# EAGLE design hires-Addon Build 003 (EAGLE 9.6.2)
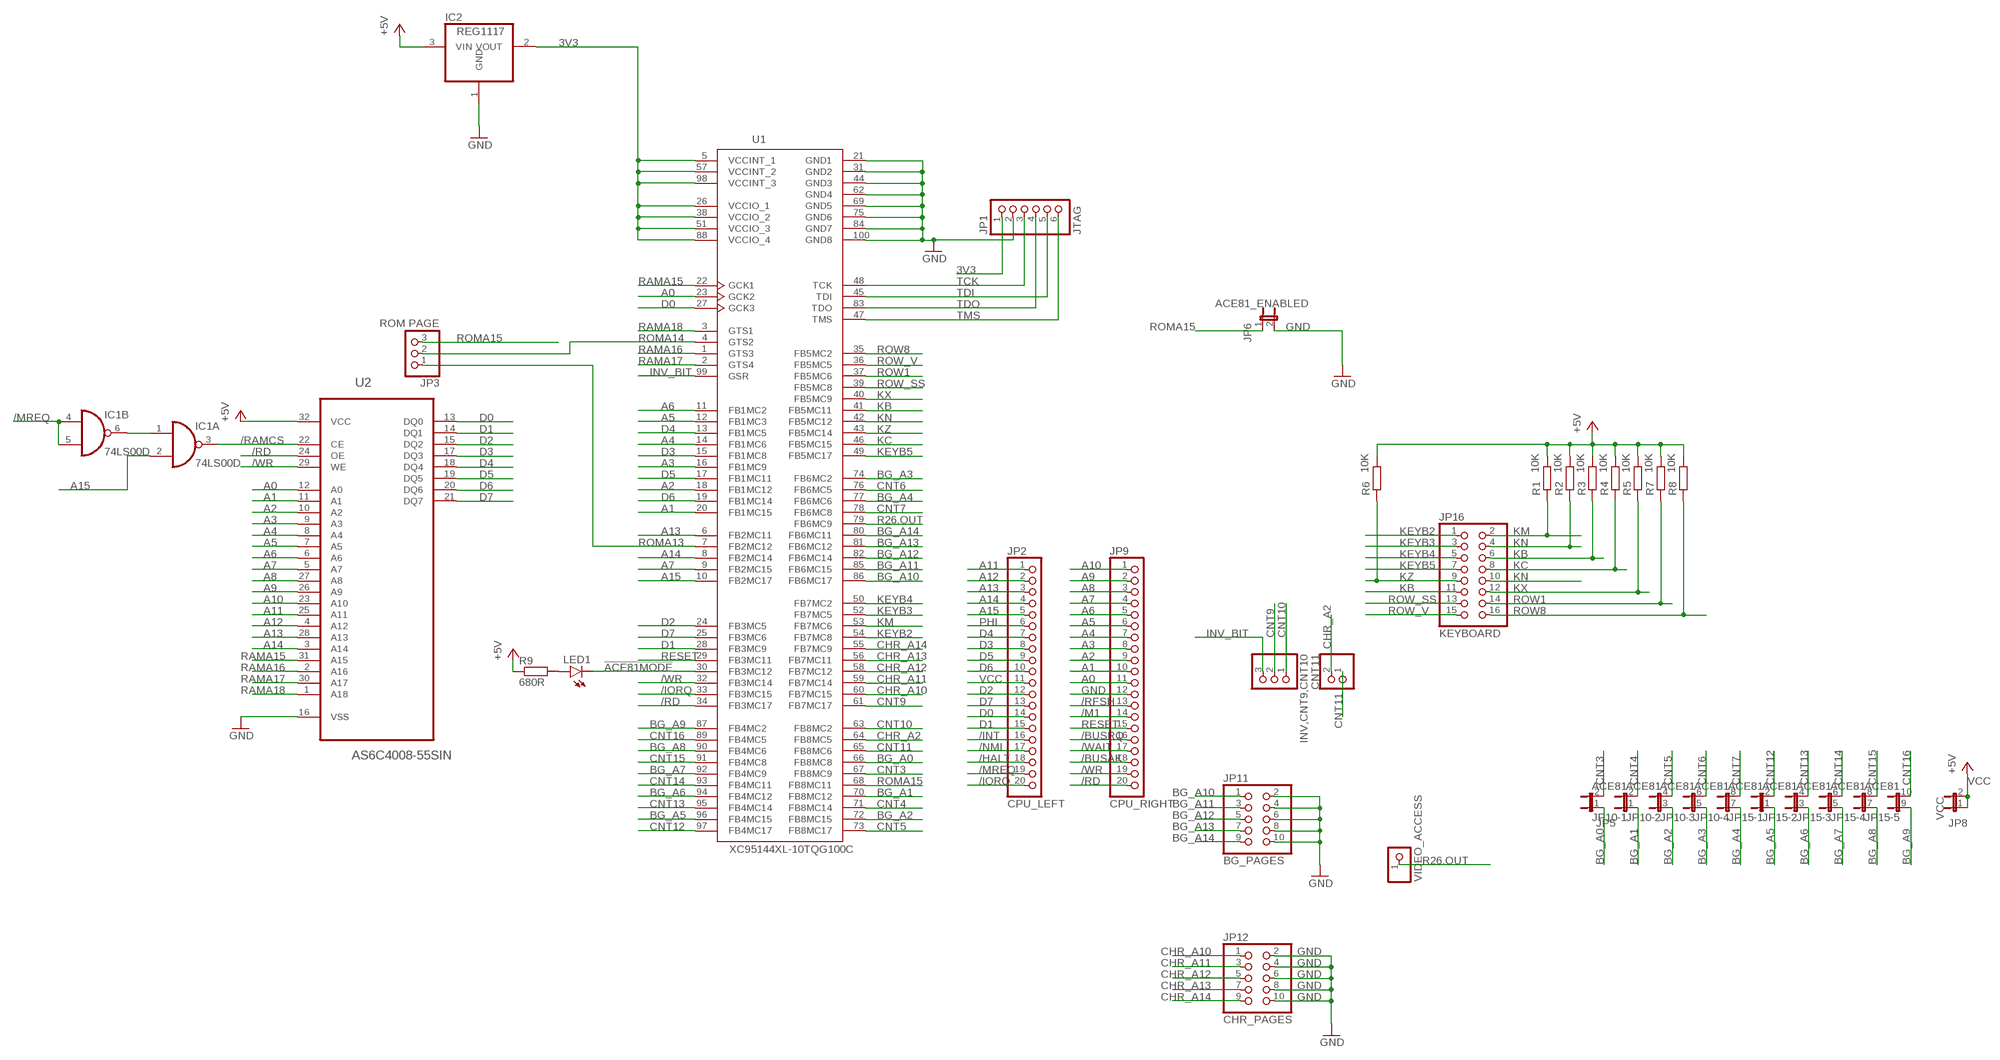
[diagram p0: schematic, sheet 1]

## Parts
CNT11  PINHD-1X2  [1X02]
IC1  74LS00D  [SO14]
IC2  REG1117  [SOT223]
INV,CNT9,CNT10  PINHD-1X3  [1X03]
JP1  JTAG  PINHD-1X6/90  [1X06/90]
JP2  CPU_LEFT  PINHD-1X20  [1X20]
JP3  ROM PAGE  PINHD-1X3  [1X03]
JP5  JP1E1Q  [JP1Q]
JP6  ACE81_ENABLED  JP1E1Q  [JP1Q]
JP8  VCC  JP1E1Q  [JP1Q]
JP9  CPU_RIGHT  PINHD-1X20  [1X20]
JP10  ACE81  JP4QE  [JP4Q]
JP11  BG_PAGES  PINHD-2X5  [2X05]
JP12  CHR_PAGES  PINHD-2X5  [2X05]
JP14  VIDEO_ACCESS  PINHD-1X1  [1X01]
JP15  ACE81  JP5QE  [JP5Q]
JP16  KEYBOARD  PINHD-2X8  [2X08]
LED1  LED3MM  [LED3MM]
R1  10K  R-EU_0204/7  [0204/7]
R2  10K  R-EU_0204/7  [0204/7]
R3  10K  R-EU_0204/7  [0204/7]
R4  10K  R-EU_0204/7  [0204/7]
R5  10K  R-EU_0204/7  [0204/7]
R6  10K  R-EU_0204/7  [0204/7]
R7  10K  R-EU_0204/7  [0204/7]
R8  10K  R-EU_0204/7  [0204/7]
R9  680R  R-EU_0204/7  [0204/7]
U1  XC95144XL-10TQG100C  [TQFP100]
U2  AS6C4008-55SIN  [SOIC127P1407X299-32N]

## Nets
3V3 [power]: IC2.2(VOUT) JP1.1 U1.5(VCCINT_1) U1.26(VCCIO_1) U1.38(VCCIO_2) U1.51(VCCIO_3) U1.57(VCCINT_2) U1.88(VCCIO_4) U1.98(VCCINT_3)
!ACE81MODE: LED1.K(C) U1.30(FB3MC12)
/BUSAK: JP9.18
/BUSRQ: JP9.16
/HALT: JP2.18
/INT: JP2.16
/IORQ: JP2.20 U1.33(FB3MC15)
/M1: JP9.14
/MREQ: IC1.4(B:I0) IC1.5(B:I1) JP2.19
/NMI: JP2.17
/RAMCS: IC1.3(A:O) U2.22(CE)
/RD: JP9.20 U1.34(FB3MC17) U2.24(OE)
/RFSH: JP9.13
/WAIT: JP9.17
/WR: JP9.19 U1.32(FB3MC14) U2.29(WE)
A0: JP9.11 U1.23(GCK2) U2.12(A0)
A1: JP9.10 U1.20(FB1MC15) U2.11(A1)
A2: JP9.9 U1.18(FB1MC12) U2.10(A2)
A3: JP9.8 U1.16(FB1MC9) U2.9(A3)
A4: JP9.7 U1.14(FB1MC6) U2.8(A4)
A5: JP9.6 U1.12(FB1MC3) U2.7(A5)
A6: JP9.5 U1.11(FB1MC2) U2.6(A6)
A7: JP9.4 U1.9(FB2MC15) U2.5(A7)
A8: JP9.3 U2.27(A8)
A9: JP9.2 U2.26(A9)
A10: JP9.1 U2.23(A10)
A11: JP2.1 U2.25(A11)
A12: JP2.2 U2.4(A12)
A13: JP2.3 U1.6(FB2MC11) U2.28(A13)
A14: JP2.4 U1.8(FB2MC14) U2.3(A14)
A15: IC1.2(A:I1) JP2.5 U1.10(FB2MC17)
BG_A0: JP5.1 U1.66(FB8MC8)
BG_A1: JP10.1 U1.70(FB8MC12)
BG_A2: JP10.3 U1.72(FB8MC15)
BG_A3: JP10.5 U1.74(FB6MC2)
BG_A4: JP10.7 U1.77(FB6MC6)
BG_A5: JP15.1 U1.96(FB4MC15)
BG_A6: JP15.3 U1.94(FB4MC12)
BG_A7: JP15.5 U1.92(FB4MC9)
BG_A8: JP15.7 U1.90(FB4MC6)
BG_A9: JP15.9 U1.87(FB4MC2)
BG_A10: JP11.1 U1.86(FB6MC17)
BG_A11: JP11.3 U1.85(FB6MC15)
BG_A12: JP11.5 U1.82(FB6MC14)
BG_A13: JP11.7 U1.81(FB6MC12)
BG_A14: JP11.9 U1.80(FB6MC11)
CHR_A2: CNT11.2 U1.64(FB8MC5)
CHR_A10: JP12.1 U1.60(FB7MC15)
CHR_A11: JP12.3 U1.59(FB7MC14)
CHR_A12: JP12.5 U1.58(FB7MC12)
CHR_A13: JP12.7 U1.56(FB7MC11)
CHR_A14: JP12.9 U1.55(FB7MC9)
CNT3: JP5.2 U1.67(FB8MC9)
CNT4: JP10.2 U1.71(FB8MC14)
CNT5: JP10.4 U1.73(FB8MC17)
CNT6: JP10.6 U1.76(FB6MC5)
CNT7: JP10.8 U1.78(FB6MC8)
CNT9: INV,CNT9,CNT10.2 U1.61(FB7MC17)
CNT10: INV,CNT9,CNT10.1 U1.63(FB8MC2)
CNT11: CNT11.1 U1.65(FB8MC6)
CNT12: JP15.2 U1.97(FB4MC17)
CNT13: JP15.4 U1.95(FB4MC14)
CNT14: JP15.6 U1.93(FB4MC11)
CNT15: JP15.8 U1.91(FB4MC8)
CNT16: JP15.10 U1.89(FB4MC5)
D0: JP2.14 U1.27(GCK3) U2.13(DQ0)
D1: JP2.15 U1.28(FB3MC9) U2.14(DQ1)
D2: JP2.12 U1.24(FB3MC5) U2.15(DQ2)
D3: JP2.8 U1.15(FB1MC8) U2.17(DQ3)
D4: JP2.7 U1.13(FB1MC5) U2.18(DQ4)
D5: JP2.9 U1.17(FB1MC11) U2.19(DQ5)
D6: JP2.10 U1.19(FB1MC14) U2.20(DQ6)
D7: JP2.13 U1.25(FB3MC6) U2.21(DQ7)
GND [power]: IC2.1(GND) JP1.2 JP6.2 JP9.12 JP11.2 JP11.4 JP11.6 JP11.8 JP11.10 JP12.2 JP12.4 JP12.6 JP12.8 JP12.10 U1.21(GND1) U1.31(GND2) U1.44(GND3) U1.62(GND4) U1.69(GND5) U1.75(GND6) U1.84(GND7) U1.100(GND8) U2.16(VSS)
INV_BIT: INV,CNT9,CNT10.3 U1.99(GSR)
KB: JP16.6 JP16.11 R3.1 U1.41(FB5MC11)
KC: JP16.8 R4.1 U1.46(FB5MC15)
KEYB2: JP16.1 U1.54(FB7MC8)
KEYB3: JP16.3 U1.52(FB7MC5)
KEYB4: JP16.5 U1.50(FB7MC2)
KEYB5: JP16.7 U1.49(FB5MC17)
KM: JP16.2 R1.1 U1.53(FB7MC6)
KN: JP16.4 JP16.10 R2.1 U1.42(FB5MC12)
KX: JP16.12 R5.1 U1.40(FB5MC9)
KZ: JP16.9 R6.1 U1.43(FB5MC14)
N$1: IC1.1(A:I0) IC1.6(B:O)
N$3: LED1.A R9.2
PHI: JP2.6
R26.OUT: JP14.1 U1.79(FB6MC9)
RAMA15: U1.22(GCK1) U2.31(A15)
RAMA16: U1.1(GTS3) U2.2(A16)
RAMA17: U1.2(GTS4) U2.30(A17)
RAMA18: U1.3(GTS1) U2.1(A18)
RESET: JP9.15 U1.29(FB3MC11)
ROMA13: JP3.1 U1.7(FB2MC12)
ROMA14: JP3.2 U1.4(GTS2)
ROMA15: JP3.3 JP6.1 U1.68(FB8MC11)
ROW1: JP16.14 R7.1 U1.37(FB5MC6)
ROW8: JP16.16 R8.1 U1.35(FB5MC2)
ROW_SS: JP16.13 U1.39(FB5MC8)
ROW_V: JP16.15 U1.36(FB5MC5)
TCK: JP1.3 U1.48(TCK)
TDI: JP1.5 U1.45(TDI)
TDO: JP1.4 U1.83(TDO)
TMS: JP1.6 U1.47(TMS)
VCC [power]: IC2.3(VIN) JP2.11 JP8.1 JP8.2 R1.2 R2.2 R3.2 R4.2 R5.2 R6.2 R7.2 R8.2 R9.1 U2.32(VCC) ; supply symbol labelled +5V
Unconnected: IC1.8(C:O) IC1.9(C:I0) IC1.10(C:I1) IC1.11(D:O) IC1.12(D:I0) IC1.13(D:I1)

## Power pins joined to a net without a drawn wire
GND: IC1.7(P:GND)
VCC: IC1.14(P:VCC)

## Library data of the parts
CNT11 = pinhead:PINHD-1X2: PIN HEADER
IC1 = 74xx-eu:74*00: Quad 2-input NAND gate
IC2 = burr-brown:REG1117: 800mA and 1A Low Dropout (LDO) Positive Regulator 1.8V, 2.5V, 2.85V, 3.3V, 5V, and Adj; MPN: REG1117; OC_FARNELL: 1097566; OC_NEWARK: 14P6981
INV,CNT9,CNT10 JP3 = pinhead:PINHD-1X3: PIN HEADER
JP1 = pinhead:PINHD-1X6: PIN HEADER
JP2 JP9 = pinhead:PINHD-1X20: PIN HEADER
JP5 JP6 JP8 = jumper:JP1E: JUMPER
JP10 = jumper:JP4QE: JUMPER
JP11 JP12 = pinhead:PINHD-2X5: PIN HEADER
JP14 = pinhead:PINHD-1X1: PIN HEADER
JP15 = jumper:JP5QE: JUMPER
JP16 = pinhead:PINHD-2X8: PIN HEADER
LED1 = led:LED: LED OSRAM: - CHIPLED LG R971, LG N971, LY N971, LG Q971, LY Q971, LO R971, LY R971 LH N974, LH R974 LS Q976, LO Q976, LY Q976 LO Q996 - Hyper CHIPLED LW Q18S LB Q993, LB Q99A, LB R99A - SideLED LS A670, LO A670, LY A670, LG A670, LP A670 LB A673, LV A673, LT A673, LW A673 LH A674 LY A675 LS A676, LA A676, LO A676, LY A676, LW A676 LS A679, LY A679, LG A679 - Hyper Micro SIDELED® LS Y876, LA Y876, LO Y876, LY Y876 LT Y87S - SmartLED LW L88C, LW L88S LB L89C, LB L89S, LG L890 LS L89K, LO L89K, LY L89K LS L896, LA L896, LO L896, LY L896 - TOPLED LS T670, LO T670, LY T670, LG T670, LP T670 LSG T670, LSP T670, LSY T670, LOP T670, LYG T670 LG T671, LOG T671, LSG T671 LB T673, LV T673, LT T673, LW T673 LH T674 LS T676, LA T676, LO T676, LY T676, LB T676, LH T676, LSB T676, LW T676 LB T67C, LV T67C, LT T67C, LS T67K, LO T67K, LY T67K, LW E67C LS E67B, LA E67B, LO E67B, LY E67B, LB E67C, LV E67C, LT E67C LW T67C LS T679, LY T679, LG T679 LS T770, LO T770, LY T770, LG T770, LP T770 LB T773, LV T773, LT T773, LW T773 LH T774 LS E675, LA E675, LY E675, LS T675 LS T776, LA T776, LO T776, LY T776, LB T776 LHGB T686 LT T68C, LB T68C - Hyper Mini TOPLED® LB M676 - Mini TOPLED Santana® LG M470 LS M47K, LO M47K, LY M47K Source: http://www.osram.convergy.de LUXEON: - LUMILED® LXK2-PW12-R00, LXK2-PW12-S00, LXK2-PW14-U00, LXK2-PW14-V00 LXK2-PM12-R00, LXK2-PM12-S00, LXK2-PM14-U00 LXK2-PE12-Q00, LXK2-PE12-R00, LXK2-PE12-S00, LXK2-PE14-T00, LXK2-PE14-U00 LXK2-PB12-K00, LXK2-PB12-L00, LXK2-PB12-M00, LXK2-PB14-N00, LXK2-PB14-P00, LXK2-PB14-Q00 LXK2-PR12-L00, LXK2-PR12-M00, LXK2-PR14-Q00, LXK2-PR14-R00 LXK2-PD12-Q00, LXK2-PD12-R00, LXK2-PD12-S00 LXK2-PH12-R00, LXK2-PH12-S00 LXK2-PL12-P00, LXK2-PL12-Q00, LXK2-PL12-R00 Source: www.luxeon.com KINGBRIGHT: KA-3528ASYC Source: www.kingbright.com
R1-R9 = rcl:R-EU_: RESISTOR, European symbol; SPICEPREFIX: R
U1 = XC95144XL-10TQG100C:XC95144XL-10TQG100C: Xilinx 9500XL series CPLD, 144 Macrocells, -10 speed grade. 100pin. Check availability <https://pricing.snapeda.com/parts/XC95144XL-10TQG100C/Xilinx%20Inc./view-part?ref=eda>; AVAILABILITY: In Stock; DESCRIPTION: IC CPLD 144MC 10NS 100TQFP; MF: Xilinx Inc.; MP: XC95144XL-10TQG100C; PACKAGE: TQFP-100 Xilinx; PRICE: None; PURCHASE-URL: https://pricing.snapeda.com/search/part/XC95144XL-10TQG100C/?ref=eda
U2 = AS6C4008-55SIN:AS6C4008-55SIN: CMOS SRAM Check availability <https://pricing.snapeda.com/parts/AS6C4008-55SIN/Alliance/view-part?ref=eda>; AVAILABILITY: In Stock; DESCRIPTION: SRAM - Asynchronous Memory IC 4Mb (512K x 8) Parallel 55 ns 32-SOP; MF: Alliance; MP: AS6C4008-55SIN; PACKAGE: SOIC-32 Alliance; PRICE: None; PURCHASE-URL: https://pricing.snapeda.com/search/part/AS6C4008-55SIN/?ref=eda

## Net classes
0 default: width 0.2 mm
1 power: width 0.2 mm

## Board
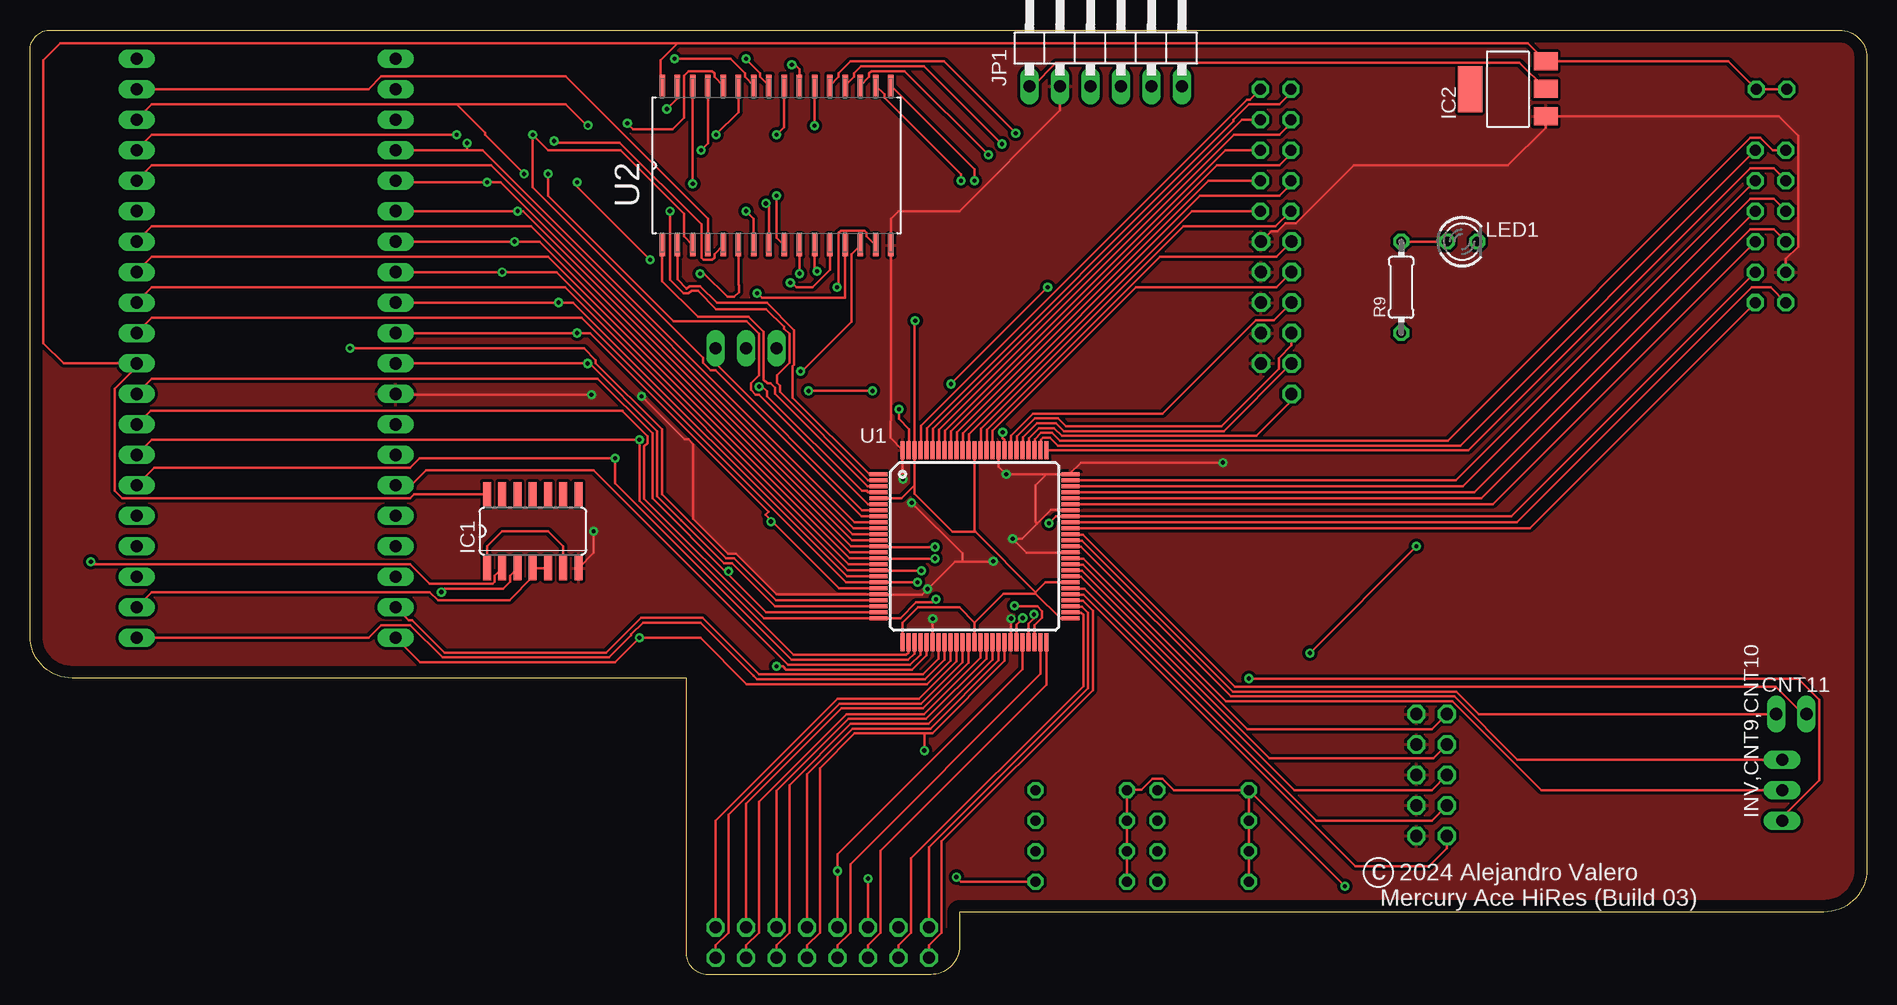
[diagram p1: board, top side]
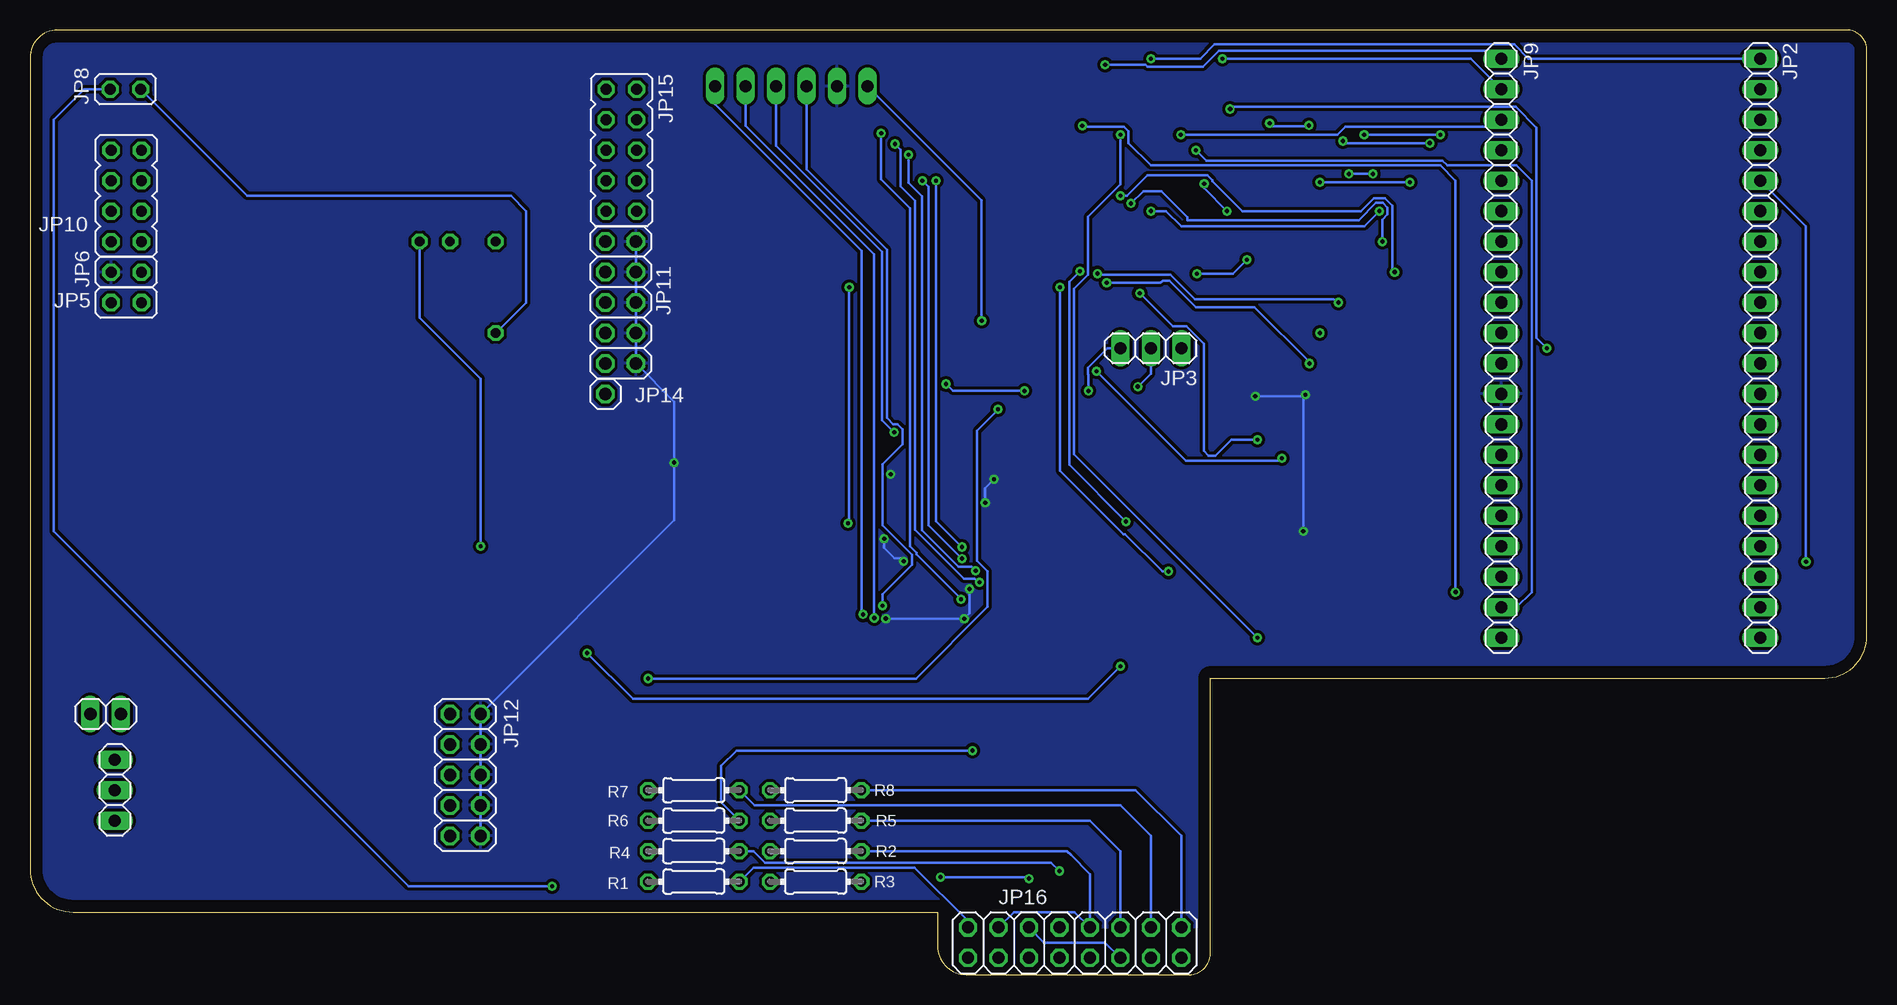
[diagram p2: board, bottom side, seen from below]

Size 153.12 x 78.72 mm. Coordinates in mm from the lower left corner, seen from the top.
Outline: 77.47,5.21 77.47,2.38 arc-90 75.09,0 56.47,0 arc-90 54.74,1.73 54.74,24.71 3.53,24.71 arc-90 0,28.24 0,77.02 arc-90 1.69,78.72 150.84,78.72 arc-90 153.12,76.44 153.12,8.79 arc-90 149.54,5.21 77.47,5.21
Copper layers (1*16): Top 0.035mm / dielectric 1.5mm / Bottom 0.035mm
Design rules "default *": minimum track width 6mil, minimum drill 10mil, track to track 8mil, track to pad 8mil, pad to pad 8mil, via to via 8mil, smd to smd 8mil, copper to edge 40mil, drill to drill 8mil, minimum pad ring 10mil, minimum via ring 8mil, stop-mask expansion 4mil, vias tented up to drill 0mil, thermal gap 10mil
vRestrict: area 14,-5 to 29.2,5.2

### Footprints (pad centres in the part's own frame; a part is rotated, then mirrored left to right if it is on the bottom)
1X02 = drill 1.016 long: 1 -1.27,0; 2 1.27,0
SO14 = smd 0.66 x 2.032: 1 -3.81,-3.073; 2 -2.54,-3.073; 3 -1.27,-3.073; 4 0,-3.073; 5 1.27,-3.073; 6 2.54,-3.073; 7 3.81,-3.073; 8 3.81,3.073; 9 2.54,3.073; 10 1.27,3.073; 11 0,3.073; 12 -1.27,3.073; 13 -2.54,3.073; 14 -3.81,3.073
SOT223 = smd 1.499 x 2.007: 1 -2.261,-3.15; 2 0.025,-3.15; 3 2.311,-3.15 | smd 3.81 x 2.007: 4 0,3.15
1X03 = drill 1.016 long: 1 -2.54,0; 2 0,0; 3 2.54,0
1X06/90 = drill 1.016 long: 1 -6.35,-3.81; 2 -3.81,-3.81; 3 -1.27,-3.81; 4 1.27,-3.81; 5 3.81,-3.81; 6 6.35,-3.81
1X20 = drill 1.016 long: 1 -24.13,0; 2 -21.59,0; 3 -19.05,0; 4 -16.51,0; 5 -13.97,0; 6 -11.43,0; 7 -8.89,0; 8 -6.35,0; 9 -3.81,0; 10 -1.27,0; 11 1.27,0; 12 3.81,0; 13 6.35,0; 14 8.89,0; 15 11.43,0; 16 13.97,0; 17 16.51,0; 18 19.05,0; 19 21.59,0; 20 24.13,0
JP1Q = drill 0.914 octagon: 1 -1.27,-1.27; 2 -1.27,1.27
JP4Q = drill 0.914 octagon: 1 -3.81,-1.27; 2 -3.81,1.27; 3 -1.27,-1.27; 4 -1.27,1.27; 5 1.27,-1.27; 6 1.27,1.27; 7 3.81,-1.27; 8 3.81,1.27
2X05 = drill 1.016 octagon: 1 -5.08,-1.27; 2 -5.08,1.27; 3 -2.54,-1.27; 4 -2.54,1.27; 5 0,-1.27; 6 0,1.27; 7 2.54,-1.27; 8 2.54,1.27; 9 5.08,-1.27; 10 5.08,1.27
1X01 = drill 1.016 octagon: 1 0,0
JP5Q = drill 0.914 octagon: 1 -5.08,-1.27; 2 -5.08,1.27; 3 -2.54,-1.27; 4 -2.54,1.27; 5 0,-1.27; 6 0,1.27; 7 2.54,-1.27; 8 2.54,1.27; 9 5.08,-1.27; 10 5.08,1.27
2X08 = drill 1.016 octagon: 1 -8.89,-1.27; 2 -8.89,1.27; 3 -6.35,-1.27; 4 -6.35,1.27; 5 -3.81,-1.27; 6 -3.81,1.27; 7 -1.27,-1.27; 8 -1.27,1.27; 9 1.27,-1.27; 10 1.27,1.27; 11 3.81,-1.27; 12 3.81,1.27; 13 6.35,-1.27; 14 6.35,1.27; 15 8.89,-1.27; 16 8.89,1.27
LED3MM = drill 0.813 octagon: A -1.27,0; K 1.27,0
0204/7 = drill 0.813 octagon: 1 -3.81,0; 2 3.81,0
TQFP100 = smd 1.5 x 0.345: 1 -8,6; 2 -8,5.5; 3 -8,5; 4 -8,4.5; 5 -8,4; 6 -8,3.5; 7 -8,3; 8 -8,2.5; 9 -8,2; 10 -8,1.5; 11 -8,1; 12 -8,0.5; 13 -8,0; 14 -8,-0.5; 15 -8,-1; 16 -8,-1.5; 17 -8,-2; 18 -8,-2.5; 19 -8,-3; 20 -8,-3.5; 21 -8,-4; 22 -8,-4.5; 23 -8,-5; 24 -8,-5.5; 25 -8,-6; 51 8,-6; 52 8,-5.5; 53 8,-5; 54 8,-4.5; 55 8,-4; 56 8,-3.5; 57 8,-3; 58 8,-2.5; 59 8,-2; 60 8,-1.5; 61 8,-1; 62 8,-0.5; 63 8,0; 64 8,0.5; 65 8,1; 66 8,1.5; 67 8,2; 68 8,2.5; 69 8,3; 70 8,3.5; 71 8,4; 72 8,4.5; 73 8,5; 74 8,5.5; 75 8,6 | smd 0.345 x 1.5: 26 -6,-8; 27 -5.5,-8; 28 -5,-8; 29 -4.5,-8; 30 -4,-8; 31 -3.5,-8; 32 -3,-8; 33 -2.5,-8; 34 -2,-8; 35 -1.5,-8; 36 -1,-8; 37 -0.5,-8; 38 0,-8; 39 0.5,-8; 40 1,-8; 41 1.5,-8; 42 2,-8; 43 2.5,-8; 44 3,-8; 45 3.5,-8; 46 4,-8; 47 4.5,-8; 48 5,-8; 49 5.5,-8; 50 6,-8; 76 6,8; 77 5.5,8; 78 5,8; 79 4.5,8; 80 4,8; 81 3.5,8; 82 3,8; 83 2.5,8; 84 2,8; 85 1.5,8; 86 1,8; 87 0.5,8; 88 0,8; 89 -0.5,8; 90 -1,8; 91 -1.5,8; 92 -2,8; 93 -2.5,8; 94 -3,8; 95 -3.5,8; 96 -4,8; 97 -4.5,8; 98 -5,8; 99 -5.5,8; 100 -6,8
SOIC127P1407X299-32N = smd 1.803 x 0.457: 1 -6.655,9.525; 2 -6.655,8.255; 3 -6.655,6.985; 4 -6.655,5.715; 5 -6.655,4.445; 6 -6.655,3.175; 7 -6.655,1.905; 8 -6.655,0.635; 9 -6.655,-0.635; 10 -6.655,-1.905; 11 -6.655,-3.175; 12 -6.655,-4.445; 13 -6.655,-5.715; 14 -6.655,-6.985; 15 -6.655,-8.255; 16 -6.655,-9.525; 17 6.655,-9.525; 18 6.655,-8.255; 19 6.655,-6.985; 20 6.655,-5.715; 21 6.655,-4.445; 22 6.655,-3.175; 23 6.655,-1.905; 24 6.655,-0.635; 25 6.655,0.635; 26 6.655,1.905; 27 6.655,3.175; 28 6.655,4.445; 29 6.655,5.715; 30 6.655,6.985; 31 6.655,8.255; 32 6.655,9.525

### Placement (x,y rotation side)
CNT11  146.81,21.72 0 bottom
IC1  41.91,36.96 0 top
IC2  123.19,73.79 90 top
INV,CNT9,CNT10  146.05,15.37 270 bottom
JP1  89.66,77.85 0 top
JP2  8.89,52.2 270 bottom
JP3  59.69,52.2 180 bottom
JP5  145.1,57.28 90 bottom
JP6  145.1,59.82 90 bottom
JP8  145.16,75.06 90 bottom
JP9  30.48,52.2 270 bottom
JP10  145.1,64.9 90 bottom
JP11  103.89,56.01 270 bottom
JP12  116.84,16.64 270 bottom
JP14  105.16,48.39 0 bottom
JP15  103.82,68.71 270 bottom
JP16  66.04,2.67 0 bottom
LED1  119.38,61.09 0 top
R1  97.79,7.75 180 bottom
R2  87.63,10.29 180 bottom
R3  87.63,7.75 180 bottom
R4  97.79,10.29 180 bottom
R5  87.63,12.83 180 bottom
R6  97.79,12.83 180 bottom
R7  97.79,15.37 180 bottom
R8  87.63,15.37 180 bottom
R9  114.3,57.28 90 top
U1  78.74,35.69 0 top
U2  62.23,67.44 90 top

### Tracks (layer width: path | path; a pad name or v marks a point on that pad's centre or on a via)
3V3  (via drill 0.35)
  Top 0.2: U1.38 78.74,29.34 | 78.74,29.34 77.47,30.61 74.04,30.61 72.74,29.31 U1.26 | 78.74,29.34 81.15,31.75 83.82,31.75 | U1.51 85.88,29.69 83.82,31.75 | U1.57 84.63,32.69 83.82,31.88 | 83.82,31.88 83.82,31.75 | 83.82,31.88 78.8,36.89 | 78.8,36.89 78.74,36.96 U1.88 | 73.74,40.77 U1.98 73.74,54.44 v73.79,54.48 | 73.74,40.77 73.74,40.05 76.9,36.89 78.8,36.89 | 73.74,40.77 72.66,39.69 U1.5 | JP1.1 83.58,74.04 85.54,76 124.16,76 IC2.2
  Bottom 0.2: JP1.1 73.79,64.52 v73.79,54.48
!ACE81MODE  (via drill 0.35)
  Top 0.2: U1.30 74.72,27.66 74.72,26.6 73.54,25.42 63.03,25.42 62.75,25.7 v62.23,25.7 | v106.68,26.8 v115.57,35.69
  Bottom 0.2: v62.23,25.7 64.94,22.99 102.87,22.99 v106.68,26.8 | v115.57,35.69 115.57,49.66 120.65,54.74 LED1.K
/IORQ
  Top 0.2: U1.33 76.22,27.66 76.22,26.24 74.59,24.62 60.6,24.62 60.33,24.89 55.88,29.34 51.11,29.34 50.12,28.35 50.12,28.3 48.26,26.44 34.38,26.44 31.68,29.13 29.28,29.13 28.21,28.07 JP2.20
/MREQ
  Top 0.2: JP2.19 10.16,31.88 33.33,31.88 34.01,31.2 39.96,31.2 41.91,33.15 IC1.4 IC1.5
/RAMCS  (via drill 0.35)
  Top 0.2: v34.29,31.88 34.57,32.16 39.42,32.16 40,32.74 40,33.25 IC1.3 | v65.41,70.74 U2.22
  Bottom 0.2: v34.29,31.88 34.29,66.17 35.56,67.44 59.69,67.44 61.55,69.3 61.55,70.26 61.95,70.66 65.32,70.66 v65.41,70.74
/RD  (via drill 0.35)
  Top 0.2: U1.34 76.72,27.66 76.72,26.17 74.76,24.22 59.73,24.22 55.88,28.07 v50.8,28.07 48.77,26.03 32.51,26.03 JP9.20 | U2.24 62.87,70.61 v62.23,69.98
  Bottom 0.2: v62.23,69.98 62.23,65.86 64.92,63.17 64.92,58.33 66.08,57.16 66.08,43.35 v50.8,28.07
/WR  (via drill 0.35)
  Top 0.2: U1.32 75.74,26.34 74.42,25.02 60.77,25.02 56.05,29.74 50.94,29.74 48.04,26.84 34.54,26.84 31.85,29.53 31.55,29.53 JP9.19 | U2.29 56.52,69.3 v55.93,68.71
  Bottom 0.2: JP9.19 29.21,30.61 27.94,31.88 27.94,66.17 29.21,67.44 34.99,67.44 35.39,67.84 55.06,67.84 v55.93,68.71
A0  (via drill 0.35)
  Top 0.2: JP9.11 v46.48,50.93 46.63,50.93 52.29,45.27 52.29,39.85 54.26,37.88 57.86,34.28 58.52,34.28 62.11,30.69 U1.23 | U2.12 66.67,58.72 65.23,57.28 63.88,57.28 63.5,57.66 v63.37,57.66
  Bottom 0.2: v46.48,50.93 46.35,50.93 51.05,55.62 55.92,55.62 58.14,57.83 58.7,57.83 58.88,57.66 v63.37,57.66
A1  (via drill 0.35)
  Top 0.2: U1.20 70.72,32.21 67.44,32.21 61.83,37.82 | JP9.10 v45.59,53.47 46.69,53.47 61.57,38.59 61.32,38.33 61.83,37.82 | U2.11 65.41,58.67 65.54,58.67 v65.6,58.61 | 61.83,37.82 v61.76,37.75
  Bottom 0.2: v65.6,58.61 66.49,57.72 66.49,42.48 v61.76,37.75
A2  (via drill 0.35)
  Top 0.2: U1.18 70.72,33.21 68.09,33.21 45.29,56.01 v44.07,56.01 JP9.9 | U2.10 v64.14,58.42
  Bottom 0.2: v44.07,56.01 44.2,56.01 44.49,56.3 56.03,56.3 58.08,58.34 64.05,58.34 v64.14,58.42
A3  (via drill 0.35)
  Top 0.2: U1.16 70.72,34.21 68.23,34.21 43.89,58.55 v39.37,58.55 JP9.8 | U2.9 62.23,61.42 v62.23,64.9
  Bottom 0.2: v62.23,64.9 61.67,64.9 59.97,66.59 54.96,66.59 54.56,66.19 54.56,66.12 52.07,63.63 42.17,63.63 41.09,64.71 40.19,64.71 39.55,64.08 39.55,58.73 v39.37,58.55
A4  (via drill 0.35)
  Top 0.2: U1.14 70.72,35.21 68.37,35.21 42.49,61.09 v40.39,61.09 JP9.7 | v61.34,64.26 61.59,64.01 U2.8
  Bottom 0.2: v61.34,64.26 60.33,65.28 58.8,65.28 56.64,63.12 56.64,62.87 42.37,62.87 40.92,64.31 40.36,64.31 39.96,63.91 39.96,63.34 40.39,62.92 v40.39,61.09
A5  (via drill 0.35)
  Top 0.2: U1.12 70.72,36.21 68.51,36.21 41.09,63.63 v40.64,63.63 JP9.6 | U2.7 60.33,62.99 v59.69,63.63
  Bottom 0.2: v59.69,63.63 58.42,63.63 57.15,62.36 41.91,62.36 v40.64,63.63
A6  (via drill 0.35)
  Top 0.2: U1.11 70.72,36.71 68.58,36.71 39.25,66.04 v38.1,66.04 30.61,66.04 JP9.5 | U2.6 59.05,57.48 59.1,57.43 59.1,56.87 58.7,56.47 58.14,56.47 56.19,58.42 55.75,58.42 55.78,58.39 v55.85,58.39 | v51.69,59.56 45.47,65.79 45.47,66.04 v45.59,66.04
  Bottom 0.2: v55.85,58.39 52.86,58.39 v51.69,59.56 | v45.59,66.04 v38.1,66.04
A7  (via drill 0.35)
  Top 0.2: U1.9 70.72,37.71 68.72,37.71 37.72,68.71 36.58,68.71 | 36.58,68.71 JP9.4 | U2.5 57.05,60.04 57.05,59.75 56.87,59.58 56.16,59.58 55.98,59.75 55.98,62.52 49.16,69.34 43.81,69.34 v43.69,69.47 | v36.45,69.3 36.45,68.83 36.58,68.71
  Bottom 0.2: v43.69,69.47 43.52,69.3 v36.45,69.3
A8  (via drill 0.35)
  Top 0.2: U2.27 59.05,71.88 57.15,69.98 v57.2,69.98
  Bottom 0.2: v57.2,69.98 44.14,69.98 43.46,70.66 31.07,70.66 JP9.3
A9  (via drill 0.35)
  Top 0.2: U2.26 59.59,74.83 59.59,75.12 58.38,76.33 v53.72,76.33
  Bottom 0.2: v53.72,76.33 33.02,76.33 JP9.2
A10  (via drill 0.35)
  Top 0.2: U2.23 64.14,75.44 63.75,75.82 v63.5,75.82
  Bottom 0.2: v63.5,75.82 60.15,75.82 59.97,75.65 55.37,75.65 54,77.01 31.16,77.01 JP9.1
A11  (via drill 0.35)
  Top 0.2: U2.25 60.86,74.83 60.86,75.12 59.69,76.29 v59.69,76.33
  Bottom 0.2: v59.69,76.33 55.57,76.33 54.38,77.52 29.4,77.52 28.21,76.33 JP2.1
A12
  Top 0.2: JP2.2 28.21,73.79 29.28,74.85 44.66,74.85 56.52,62.99 U2.4
A13  (via drill 0.35)
  Top 0.2: U1.6 70.72,39.21 69.86,39.21 60.76,48.32 60.5,48.32 60.1,48.72 60.1,49.28 60.76,49.94 60.76,53.4 59.73,54.43 53.65,54.43 43.18,64.9 v43.18,66.72 | JP2.3 10.16,72.52 35.56,72.52 | U2.28 57.05,74.83 57.05,75.12 56.87,75.3 54.89,75.3 54.51,74.91 54.51,71.41 53.55,70.45 50.27,70.45 v49.79,70.94 | v41.18,66.72 37.93,69.97 37.93,70.14 35.56,72.52 | 35.56,72.52 44.63,72.52 46.38,70.76 v46.51,70.76
  Bottom 0.2: v49.79,70.94 49.53,70.68 46.59,70.68 v46.51,70.76 | v43.18,66.72 v41.18,66.72
A14  (via drill 0.35)
  Top 0.2: U1.8 70.72,38.21 69.3,38.21 57.14,50.37 56.71,50.37 56.09,50.99 56.09,51.42 41.91,65.6 v41.91,69.98 43.18,68.71 49.22,68.71 54.51,63.42 54.51,61.52 U2.3 | v35.56,69.98 10.16,69.98 JP2.4
  Bottom 0.2: v41.91,69.98 v35.56,69.98
A15  (via drill 0.35)
  Top 0.2: U1.10 70.72,37.21 68.65,37.21 38.42,67.44 10.16,67.44 JP2.5 | IC1.2 38.73,33.25 38.73,32.74 38.56,32.56 33.33,32.56 31.68,34.21 5.29,34.21 v5.08,34.42
  Bottom 0.2: v5.08,34.42 5.08,62.36 JP2.5
BG_A0
  Top 0.2: U1.66 125.01,37.19 JP5.1
BG_A1
  Top 0.2: U1.70 121.93,39.19 JP10.1
BG_A2
  Top 0.2: U1.72 120.39,40.19 JP10.3
BG_A3
  Top 0.2: U1.74 118.85,41.19 JP10.5
BG_A4
  Top 0.2: U1.77 84.26,43.71 84.26,44.56 84.44,44.74 85.04,44.74 85.69,44.09 119.21,44.09 JP10.7
BG_A5
  Top 0.2: U1.96 74.76,43.71 74.76,45.54 100.33,71.11 100.33,71.25 101.6,72.52 104.14,72.52 105.09,73.47 JP15.1
BG_A6
  Top 0.2: U1.94 75.76,43.71 75.76,45.4 100.34,69.98 104.14,69.98 105.09,70.93 JP15.3
BG_A7
  Top 0.2: U1.92 76.76,43.71 76.76,45.26 98.94,67.44 104.14,67.44 105.09,68.39 JP15.5
BG_A8
  Top 0.2: U1.90 77.76,43.71 77.76,45.12 97.54,64.9 104.14,64.9 105.09,65.85 JP15.7
BG_A9
  Top 0.2: U1.87 79.26,43.71 79.26,45.48 96.14,62.36 103.82,62.36 JP15.9
BG_A10
  Top 0.2: U1.86 79.76,43.71 79.76,45.41 94.17,59.82 103.89,59.82 JP11.1
BG_A11
  Top 0.2: U1.85 80.24,45.31 92.2,57.28 103.89,57.28 JP11.3
BG_A12
  Top 0.2: U1.82 81.76,43.71 81.76,44.91 83.61,46.76 94.4,46.76 102.17,54.53 103.68,54.53 JP11.5
BG_A13
  Top 0.2: U1.81 82.26,43.71 82.26,44.84 83.77,46.35 85.71,46.35 86.36,45.7 99.31,45.7 104.09,50.48 104.09,51.37 105.16,52.43 JP11.7
BG_A14
  Top 0.2: U1.80 82.76,43.71 82.76,44.77 83.94,45.95 85.54,45.95 86.19,45.3 99.53,45.3 JP11.9
CHR_A2
  Top 0.2: U1.64 86.76,36.16 87.69,36.16 100.26,23.59 118.89,23.59 120.76,21.72 CNT11.2
CHR_A10
  Top 0.2: U1.60 86.76,34.16 87.76,34.16 101.47,20.45 116.84,20.45 JP12.1
CHR_A11
  Top 0.2: U1.59 86.76,33.66 87.69,33.66 103.31,18.03 116.97,18.03 JP12.3
CHR_A12
  Top 0.2: U1.58 86.76,33.16 87.62,33.16 105.41,15.37 116.84,15.37 JP12.5
CHR_A13
  Top 0.2: U1.56 86.76,32.16 87.9,32.16 107.23,12.83 116.84,12.83 JP12.7
CHR_A14
  Top 0.2: U1.55 86.76,31.66 87.83,31.66 110.47,9.02 116.59,9.02 118.11,10.54 JP12.9
CNT3
  Top 0.2: U1.67 123.92,37.69 143.51,57.28 145.1,57.28 JP5.2
CNT4
  Top 0.2: U1.71 120.99,39.69 143.41,62.1 145.03,62.1 145.35,62.1 JP10.2
CNT5
  Top 0.2: U1.73 119.45,40.69 143.41,64.64 144.78,64.64 145.35,64.64 JP10.4
CNT6
  Top 0.2: U1.76 119.91,43.69 143.41,67.18 145.16,67.18 145.35,67.18 JP10.6
CNT7
  Top 0.2: U1.78 83.76,43.71 83.76,44.63 84.28,45.14 85.2,45.14 85.86,44.49 118.18,44.49 143.41,69.72 144.25,69.72 145.26,68.71 JP10.8
CNT9
  Top 0.2: U1.61 86.76,34.66 87.83,34.66 99.71,22.78 118.55,22.78 125.97,15.37 INV,CNT9,CNT10.2
CNT10
  Top 0.2: U1.63 86.76,35.66 87.62,35.66 100.09,23.19 118.72,23.19 124,17.91 INV,CNT9,CNT10.1
CNT11
  Top 0.2: U1.65 86.76,36.66 87.76,36.66 100.43,23.99 145.54,23.99 147.81,21.72 CNT11.1
CNT12
  Top 0.2: U1.97 74.26,43.71 74.26,45.75 101.43,72.92 101.69,72.92 JP15.2
CNT13
  Top 0.2: U1.95 75.26,43.71 75.26,45.47 101.04,71.25 JP15.4
CNT14
  Top 0.2: U1.93 76.26,43.71 76.26,45.33 99.64,68.71 JP15.6
CNT15
  Top 0.2: U1.91 77.26,43.71 77.26,45.19 98.24,66.17 JP15.8
CNT16
  Top 0.2: U1.89 78.26,43.71 78.26,45.05 96.84,63.63 JP15.10
D0  (via drill 0.35)
  Top 0.2: U1.27 73.22,27.66 73.22,26.81 73.04,26.63 63.66,26.63 50.8,39.5 v50.8,44.58 10.16,44.58 JP2.14 | U2.13 67.94,56.39 61.01,56.39 v60.61,56.78
  Bottom 0.2: v50.8,44.58 52.98,44.58 54.31,43.24 54.88,43.24 55.27,43.64 55.27,52.59 56.71,54.02 57.86,54.02 v60.61,56.78
D1  (via drill 0.35)
  Top 0.2: U1.28 73.72,27.66 73.72,26.74 73.2,26.23 63.5,26.23 48.77,40.96 v48.77,43.02 32.46,43.02 31.68,42.24 10.37,42.24 JP2.15 | U2.14 68.48,60.04 68.48,54.41 64.36,50.29 v64.24,50.29
  Bottom 0.2: v64.24,50.29 56.78,42.84 48.95,42.84 v48.77,43.02
D2  (via drill 0.35)
  Top 0.2: U1.24 70.72,30.21 61.36,30.21 58.23,33.33 | JP2.12 10.16,49.66 47.33,49.66 51.88,45.1 51.88,39.68 58.23,33.33 | U2.15 69.75,61.52 69.75,61.81 69.57,61.99 67.59,61.99 67.41,61.81 67.41,57.43 v67.26,57.28 | v58.23,33.6 58.23,33.33
  Bottom 0.2: v67.26,57.28 67.26,41.99 61.98,36.7 61.85,36.7 58.74,33.6 v58.23,33.6
D3  (via drill 0.35)
  Top 0.2: JP2.8 10.16,59.82 43.19,59.82 68.3,34.71 70.72,34.71 U1.15 70.76,34.67 v75.44,34.67 | U2.17 78.74,67.11 v78.74,66.17
  Bottom 0.2: v78.74,66.17 78.23,65.66 78.23,37.47 v75.44,34.67
D4  (via drill 0.35)
  Top 0.2: JP2.7 10.16,62.36 41.79,62.36 68.44,35.71 70.72,35.71 U1.13 70.76,35.66 71.62,35.66 71.65,35.63 v75.43,35.63 | U2.18 71.22,73.35 71.22,73.06 77.6,66.69 v77.6,66.17
  Bottom 0.2: v77.6,66.17 77.6,37.79 v75.43,35.63
D5  (via drill 0.35)
  Top 0.2: JP2.9 10.16,57.28 44.59,57.28 68.16,33.71 70.72,33.71 U1.17 70.76,33.66 71.62,33.66 v74.3,33.66 | U2.19 69.95,74.83 69.95,75.12 70.13,75.3 72.91,75.3 v79.88,68.33
  Bottom 0.2: v79.88,68.33 79.88,65.97 78.76,64.85 78.76,37.03 75.72,33.99 74.63,33.99 v74.3,33.66
D6  (via drill 0.35)
  Top 0.2: JP2.10 10.16,54.74 45.99,54.74 68.02,32.71 70.72,32.71 U1.19 v73.98,32.69 | U2.20 68.68,74.83 68.68,75.12 69.26,75.7 74.54,75.7 v81.03,69.22
  Bottom 0.2: v73.98,32.69 74.03,32.64 74.04,32.64 74.38,32.97 75.27,32.97 79.35,37.05 79.35,64.49 80.56,65.71 80.56,68.75 v81.03,69.22
D7  (via drill 0.35)
  Top 0.2: JP2.13 10.04,47 49.41,47 49.41,46.93 51.48,44.86 51.48,44.29 51.2,44.02 51.2,39.66 61.18,29.69 U1.25 72.55,29.69 73.87,31.01 75.23,31.01 v75.51,31.29 | U2.21 67.41,74.83 67.41,75.12 68.4,76.1 76.17,76.1 v82.17,70.1
  Bottom 0.2: v82.17,70.1 82.17,66.29 79.76,63.88 79.76,35.7 79.21,35.15 79.21,35.01 75.31,31.11 75.33,31.11 v75.51,31.29
GND  (via drill 0.35)
  Top 0.2: U1.31 75.24,29.52 75.31,29.59 v75.25,29.65 | v81.79,29.67 81.79,28.59 81.76,28.56 81.76,27.71 U1.44 | U1.62 86.72,35.16 83.07,35.16 v81.92,36.32 82.68,36.32 83.95,37.59 | 83.95,37.59 85.09,38.73 85.84,38.73 85.86,38.71 86.72,38.71 U1.69 | U1.75 86.61,41.69 | 86.61,41.69 84.74,41.69 | 84.74,41.69 83.82,40.77 83.82,37.72 83.95,37.59 | 84.74,41.69 v81.38,41.69 80.74,42.32 U1.84 | v72.77,41.28 72.74,41.31 U1.100 71.71,44.72 71.71,46.13 71.75,46.18 U2.16 71.75,62.99 72.39,63.63 77.47,63.63 85.85,72.01 JP1.2 | v80.29,34.44 80.26,34.42 77.72,34.42 | 77.72,34.42 77.09,34.42 v74.8,32.13 74.33,31.66 70.76,31.66 U1.21 62.25,31.69 58.85,35.08 58.19,35.08 55.27,38 55.27,44.21 54.88,44.61 54.58,44.61 v50.99,48.2 | JP11.2 103.48,61.95 103.99,61.95 104.65,62.61 105.51,62.61 110.34,67.44 123.19,67.44 126.34,70.59 IC2.1 145.77,71.53 147.38,69.91 147.38,60.67 146.37,59.65 JP6.2 | v46.8,48.32 30.54,48.32 JP9.12 | v73.5,39.33 77.72,35.1 77.72,34.42 | v99.44,42.67 87.6,42.67 86.61,41.69 | IC1.7 46.99,35.15 v46.99,36.96
  Bottom 0.2: v81.79,29.67 81.77,29.65 v75.25,29.65 74.8,30.1 v74.8,32.13 | v81.92,36.32 81.92,35.56 81.05,34.7 80.54,34.7 v80.29,34.44 | JP11.2 JP11.4 JP11.6 JP11.8 JP11.10 99.44,47.75 v99.44,42.67 99.44,37.85 JP12.2 JP12.4 JP12.6 JP12.8 JP12.10 | v50.99,48.2 46.99,48.2 | v46.8,48.32 46.86,48.26 46.93,48.32 46.99,48.32 46.99,48.2 | v72.77,41.28 73.5,40.55 v73.5,39.33 | v46.99,36.96 46.99,48.2
  pour Top (isolate 0.254): 0,78.87 153.67,78.87 153.67,3.94 0,3.94
  pour Bottom (isolate 0.254): 0,78.87 153.67,78.87 153.67,3.94 0,3.94
INV_BIT  (via drill 0.35)
  Top 0.2: v101.6,24.67 147.39,24.67 149.15,22.92 149.15,16.2 146.05,13.1 INV,CNT9,CNT10.3 | v72.44,47.12 72.44,46.31 73.28,45.47 73.28,44.58 73.26,44.56 73.26,43.71 U1.99
  Bottom 0.2: v101.6,24.67 79.27,24.67 73.3,30.64 73.3,33.62 74.18,34.5 74.18,45.33 72.39,47.12 v72.44,47.12
KB  (via drill 0.35)
  Top 0.2: U1.41 80.22,27.66 80.22,26.25 74.88,20.91 68.41,20.91 63.3,15.8 63.3,3.5 62.23,2.43 JP16.11 | v69.85,8 JP16.6 | R3.1 77.6,7.75 v77.22,8.13
  Bottom 0.2: JP16.11 63.5,2.67 68.58,2.67 JP16.6 | v77.22,8.13 69.98,8.13 v69.85,8
KC  (via drill 0.35)
  Top 0.2: U1.46 82.74,25.46 67.31,10.03 v67.31,8.64 JP16.8
  Bottom 0.2: v67.31,8.64 68,9.32 91.84,9.32 92.8,10.29 R4.1
KEYB2
  Top 0.2: U1.54 86.76,31.16 87.76,31.16 88.6,30.32 88.6,23.7 76,11.1 76,3.5 74.93,2.43 JP16.1
KEYB3
  Top 0.2: U1.52 86.76,30.16 87.62,30.16 87.79,29.98 87.79,24.04 73.45,9.7 73.45,3.5 72.39,2.43 JP16.3
KEYB4
  Top 0.2: U1.50 84.74,24.16 70.92,10.34 70.92,3.5 69.85,2.43 JP16.5
KEYB5
  Top 0.2: U1.49 84.24,25.06 68.38,9.19 68.38,3.5 67.31,2.43 JP16.7
KM
  Top 0.2: U1.53 86.76,30.66 87.69,30.66 88.2,30.15 88.2,23.87 74.93,10.61 JP16.2
  Bottom 0.2: JP16.2 74.93,4.47 79.38,8.92 92.81,8.92 R1.1
KN
  Top 0.2: U1.42 80.74,26.2 75.04,20.51 68.57,20.51 64.77,16.7 JP16.10
  Bottom 0.2: JP16.4 71.12,5.21 66.04,5.21 JP16.10 64.77,8.38 66.36,9.97 66.67,10.29 R2.1
KX
  Top 0.2: U1.40 79.72,27.66 79.72,26.32 74.71,21.31 68.24,21.31 62.23,15.3 JP16.12
  Bottom 0.2: JP16.12 62.23,10.29 64.77,12.83 R5.1
KZ  (via drill 0.35)
  Top 0.2: U1.43 81.24,26.14 75.21,20.1 74.55,20.1 | 74.55,20.1 68.74,20.1 65.83,17.2 65.83,3.5 64.77,2.43 JP16.9 | v74.55,18.67 74.55,20.1
  Bottom 0.2: v74.55,18.67 94.23,18.67 95.5,17.4 95.5,14.35 R6.1
N$1
  Top 0.2: IC1.1 38.1,35.69 39.37,36.96 43.18,36.96 44.45,35.69 IC1.6
N$3
  Top 0.2: LED1.A R9.2
R26.OUT
  Top 0.2: U1.79 83.26,43.71 83.26,44.7 84.11,45.55 85.37,45.55 86.02,44.9 102.23,44.9 105.16,47.82 JP14.1
RAMA15  (via drill 0.35)
  Top 0.2: U1.22 62.18,31.19 58.68,34.68 58.03,34.68 52.69,40.02 52.69,45.43 47.16,50.96 47.16,51.21 46.18,52.2 v26.67,52.2 | v53.09,72.14 53.98,73.03 U2.31
  Bottom 0.2: v26.67,52.2 27.54,53.06 27.54,70.57 29.28,72.31 52.91,72.31 v53.09,72.14
RAMA16
  Top 0.2: U2.2 53.98,58.55 53.98,58.42 53.98,57.95 54.75,57.17 54.96,57.38 55.86,57.38 57.26,55.98 61.42,55.98 63.7,53.71 63.7,50.83 63.55,50.68 63.55,48.09 69.96,41.69 U1.1
RAMA17  (via drill 0.35)
  Top 0.2: 69.86,41.21 70.72,41.21 U1.2 69.89,41.19 69.86,41.21 | v53.34,63.63 53.34,57.91 54.48,56.77 54.92,56.77 55.13,56.98 55.69,56.98 57.21,55.47 61.37,55.47 62.87,53.97 62.87,53.83 63.3,53.4 63.3,50.99 62.26,49.96 62.26,49.31 62.52,49.05 62.52,48.55 69.86,41.21 | v55.24,65.91 55.24,68.71 U2.30
  Bottom 0.2: v53.34,63.63 55.24,65.53 v55.24,65.91
RAMA18
  Top 0.2: U2.1 52.7,57.8 55.67,54.83 59.9,54.83 61.16,53.57 61.16,49.59 61.46,49.28 61.72,49.28 62.12,48.88 62.12,48.39 69.79,40.71 70.03,40.71 70.06,40.69 U1.3
RESET
  Top 0.2: U1.29 74.22,27.66 74.22,26.67 73.37,25.83 63.2,25.83 46.99,42.04 33.02,42.04 31.75,40.77 JP9.15
ROMA13
  Top 0.2: U1.7 70.72,38.71 69.37,38.71 57.15,50.93 JP3.1
ROMA14  (via drill 0.35)
  Top 0.2: U1.4 70.72,40.21 69.85,40.21 69.75,40.31 69.34,40.31 61.44,48.21 61.44,48.6 61.04,49 v60.78,49
  Bottom 0.2: v60.78,49 59.69,50.09 JP3.2
ROMA15  (via drill 0.35)
  Top 0.2: JP6.1 123.47,38.19 U1.68 85.51,38.19 v84.94,37.62 | v64.9,48.64 v70.23,48.64 | v76.77,49.22 v84.83,57.28
  Bottom 0.2: v64.9,48.64 64.9,49.99 64.92,50.01 64.92,50.57 63.29,52.2 JP3.3 | v70.23,48.64 76.19,48.64 v76.77,49.22 | v84.83,57.28 84.83,37.72 v84.94,37.62
ROW1
  Top 0.2: U1.37 78.24,25.99 74.44,22.18 67.65,22.18 59.69,14.22 JP16.14
  Bottom 0.2: JP16.14 59.69,11.56 62.23,14.1 92.71,14.1 R7.1
ROW8
  Top 0.2: U1.35 77.22,27.66 77.22,26.1 74.1,22.99 67.31,22.99 57.15,12.83 JP16.16
  Bottom 0.2: JP16.16 57.15,11.56 60.96,15.37 R8.1
ROW_SS
  Top 0.2: U1.39 79.22,27.66 79.22,26.39 74.54,21.72 68.07,21.72 60.76,14.4 60.76,3.5 59.69,2.43 JP16.13
ROW_V
  Top 0.2: U1.36 77.72,27.66 77.72,26.03 74.27,22.58 67.48,22.58 58.22,13.32 58.22,3.5 57.15,2.43 JP16.15
TCK  (via drill 0.35)
  Top 0.2: U1.48 83.74,29.11 84.36,29.73 84.36,30.3 83.97,30.69 82.11,30.69 v82.07,30.73
  Bottom 0.2: v82.07,30.73 82.07,31.7 79.61,34.16 79.61,34.98 82.07,37.44 82.07,42.52 80.39,44.2 80.39,45.47 80.8,45.88 81.18,45.88 81.7,46.39 81.7,60.42 88.39,67.12 JP1.3
TDI  (via drill 0.35)
  Top 0.2: U1.45 82.24,29.16 82.47,29.39 82.47,29.44 v82.75,29.72
  Bottom 0.2: v82.75,29.72 82.75,60.01 93.47,70.74 JP1.5
TDO  (via drill 0.35)
  Top 0.2: U1.83 81.22,43.71 81.22,44.56 81.08,44.7 v81.08,45.19
  Bottom 0.2: v81.08,45.19 82.1,46.21 82.1,60.25 90.93,69.09 JP1.4
TMS  (via drill 0.35)
  Top 0.2: U1.47 83.24,29.25 83.68,29.69 v83.68,30.01
  Bottom 0.2: v83.68,30.01 83.82,30.15 83.82,60.32 96.01,72.52 JP1.6
VCC  (via drill 0.35)
  Top 0.2: JP8.2 JP8.1 141.58,76.1 IC2.3 124.84,77.6 53.98,77.6 | 53.98,77.6 52.58,76.2 52.58,74.22 U2.32 | 53.98,77.6 2.54,77.6 1.12,76.18 1.12,52.6 2.79,50.93 JP2.11 8.89,50.66 7.06,48.83 7.06,40.33 7.69,39.7 31.68,39.7 32.01,40.03 IC1.14 | R3.2 R2.2 R5.2 R8.2 91.49,15.41 92.66,15.41 93.58,16.33 94.38,16.33 95.34,15.37 R7.2 | R7.2 R6.2 R4.2 R1.2 | R7.2 v109.6,7.37
  Bottom 0.2: v109.6,7.37 121.54,7.37 151.13,36.96 151.13,71.25 148.59,73.79 JP8.2 | R9.1 111.76,56.01 111.76,63.63 113.03,64.9 135,64.9 JP8.1

### Text on the board
tNames: 2024 Alejandro Valero / Mercury Ace HiRes (Build 03) | c
tValues: VREF | GND | TCK | TDO | TDI | TMS
201bmp: C:/Users/aleja/OneDrive/Documentos/Mercury Ace_.bmp